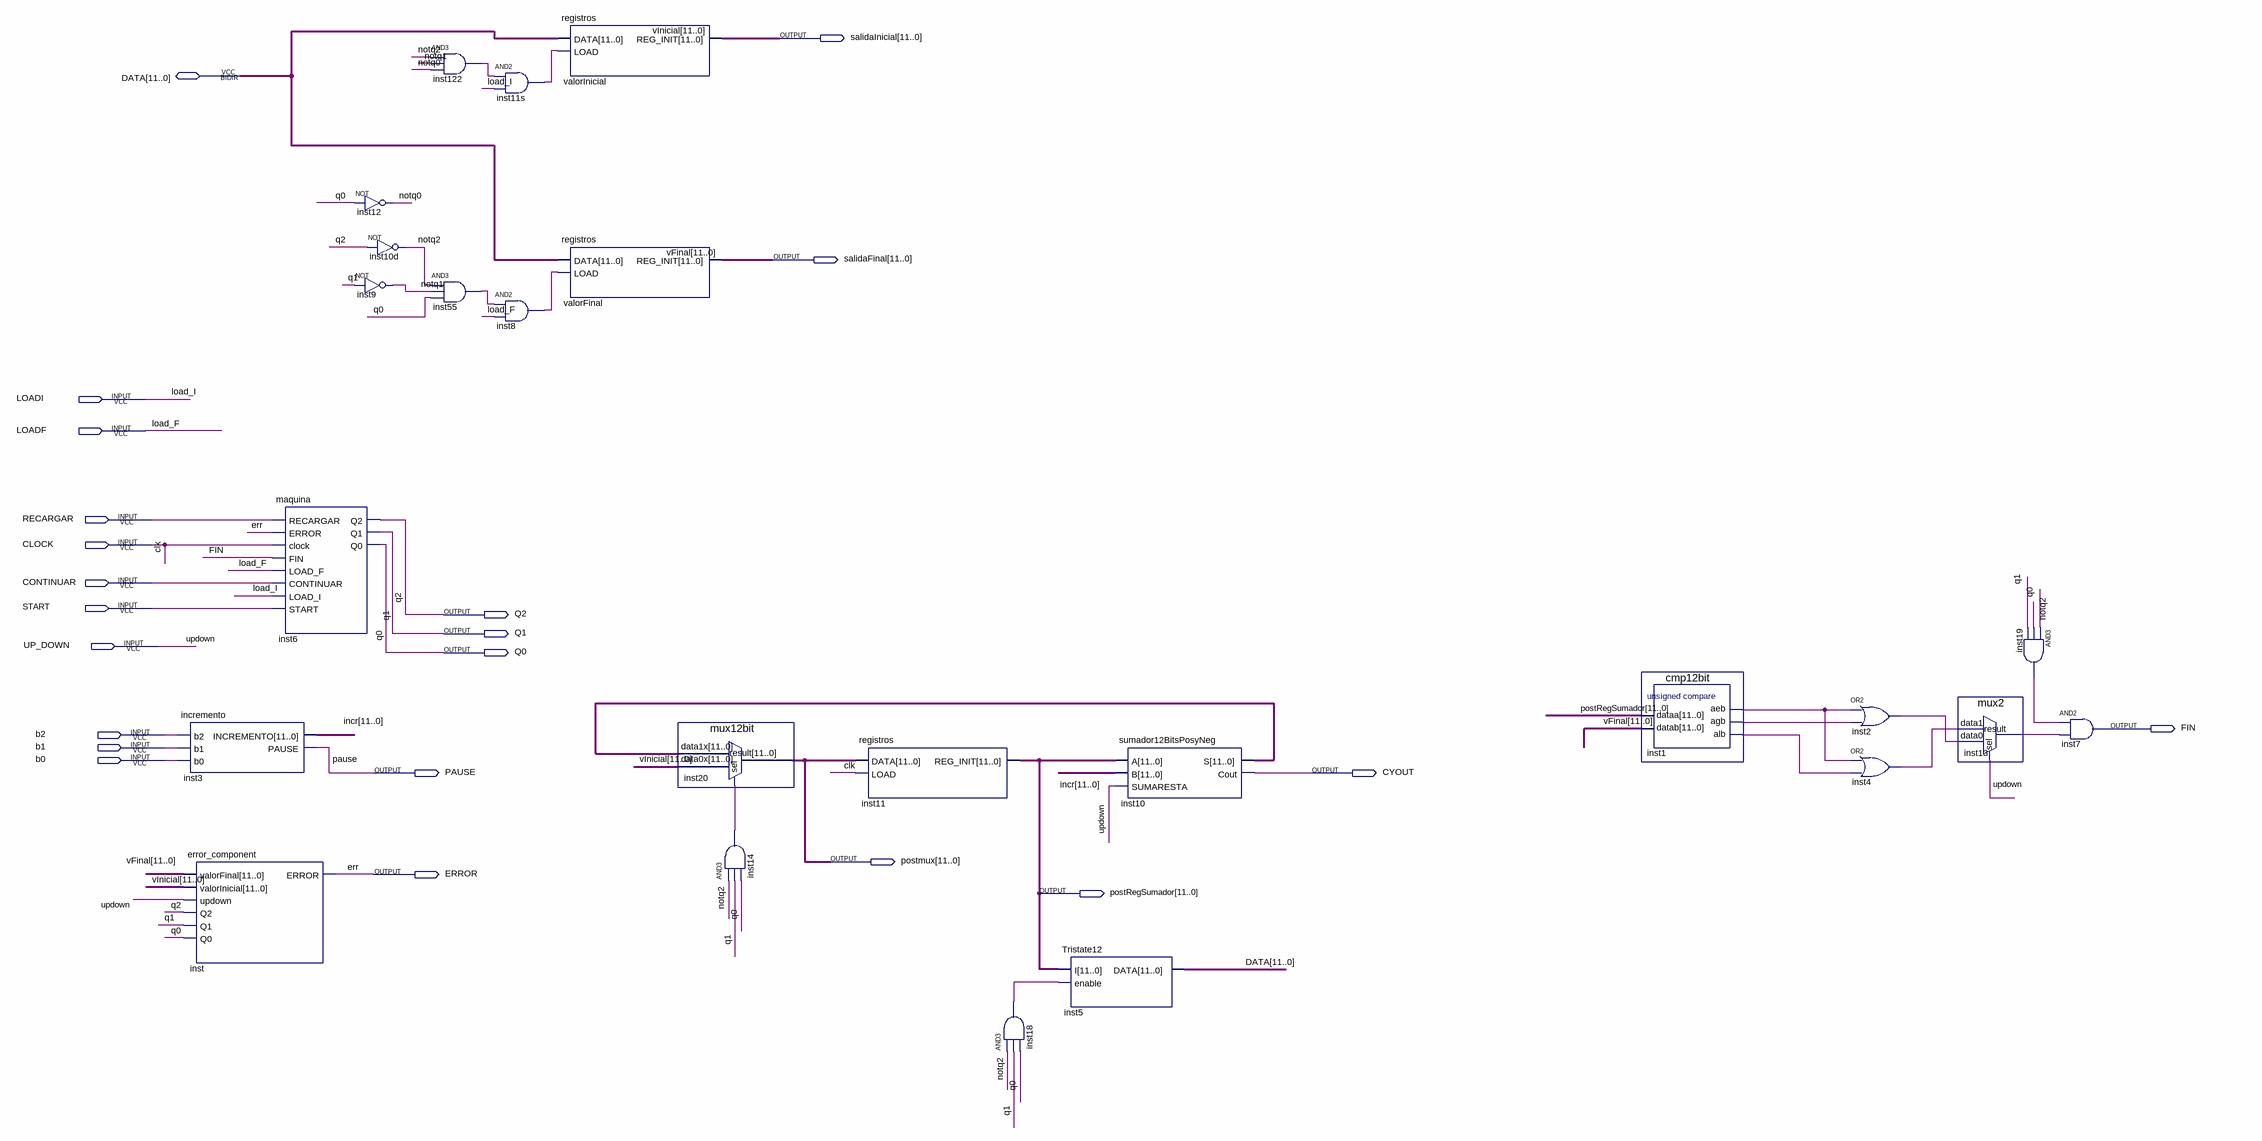
[diagram p0: schematic sheet]
// Quartus schematic Integrador.bdf as structural Verilog: 24 symbols, 22 pins
module Integrador (
  input  LOADI,
  input  LOADF,
  input  RECARGAR,
  input  CLOCK,
  input  CONTINUAR,
  input  START,
  input  UP_DOWN,
  input  b2,
  input  b1,
  input  b0,
  inout  [11:0] DATA,
  output [11:0] salidaInicial,
  output [11:0] salidaFinal,
  output Q2,
  output Q1,
  output Q0,
  output FIN,
  output PAUSE,
  output CYOUT,
  output [11:0] postmux,
  output ERROR,
  output [11:0] postRegSumador
);

  wire inst1_aeb, inst1_agb, inst1_alb, inst2_out, inst4_out, inst8_out, inst11s_out, inst13_result,
       inst14_out, inst18_out, inst19_out, inst55_out, inst122_out, notq0, notq1, notq2;
  wire [11:0] incr, inst10_s;

  incremento inst3 (.b2(b2), .b1(b1), .b0(b0), .INCREMENTO(incr), .PAUSE(PAUSE));
  error_component inst (
    .valorFinal(salidaFinal), .valorInicial(salidaInicial), .updown(UP_DOWN), .Q2(Q2), .Q1(Q1), .Q0(Q0),
    .ERROR(ERROR));
  maquina inst6 (
    .RECARGAR(RECARGAR), .ERROR(ERROR), .clock(CLOCK), .FIN(FIN), .LOAD_F(LOADF), .CONTINUAR(CONTINUAR),
    .LOAD_I(LOADI), .START(START), .Q2(Q2), .Q1(Q1), .Q0(Q0));
  not inst12 (notq0, Q0);
  not inst10d (notq2, Q2);
  not inst9 (notq1, Q1);
  and inst122 (inst122_out, notq2, notq1, notq0);
  and inst55 (inst55_out, notq2, notq1, Q0);
  and inst11s (inst11s_out, inst122_out, LOADI);
  and inst8 (inst8_out, inst55_out, LOADF);
  registros valorInicial (.DATA(DATA), .LOAD(inst11s_out), .REG_INIT(salidaInicial));
  registros valorFinal (.DATA(DATA), .LOAD(inst8_out), .REG_INIT(salidaFinal));
  mux12bit inst20 (.data1x(inst10_s), .data0x(salidaInicial), .sel(inst14_out), .result(postmux));
  and inst14 (inst14_out, notq2, Q1, Q0);
  registros inst11 (.DATA(postmux), .LOAD(CLOCK), .REG_INIT(postRegSumador));
  and inst18 (inst18_out, notq2, Q1, Q0);
  Tristate12 inst5 (.I(postRegSumador), .enable(inst18_out), .DATA(DATA));
  sumador12BitsPosyNeg inst10 (.A(postRegSumador), .B(incr), .SUMARESTA(UP_DOWN), .S(inst10_s), .Cout(CYOUT));
  cmp12bit inst1 (.dataa(postRegSumador), .datab(salidaFinal), .aeb(inst1_aeb), .agb(inst1_agb), .alb(inst1_alb));
  or inst2 (inst2_out, inst1_aeb, inst1_agb);
  or inst4 (inst4_out, inst1_aeb, inst1_alb);
  mux2 inst13 (.data1(inst4_out), .data0(inst2_out), .sel(UP_DOWN), .result(inst13_result));
  and inst19 (inst19_out, notq2, Q1, Q0);
  and inst7 (FIN, inst19_out, inst13_result);

  // Other names for the same wires on the sheet: clk = CLOCK; err = ERROR; load_F = LOADF; load_I = LOADI;
  //   updown = UP_DOWN; vFinal[11:0] = salidaFinal; vInicial[11:0] = salidaInicial
endmodule
